# EAGLE schematic ENGI301_Project2b (EAGLE 8.7.0)
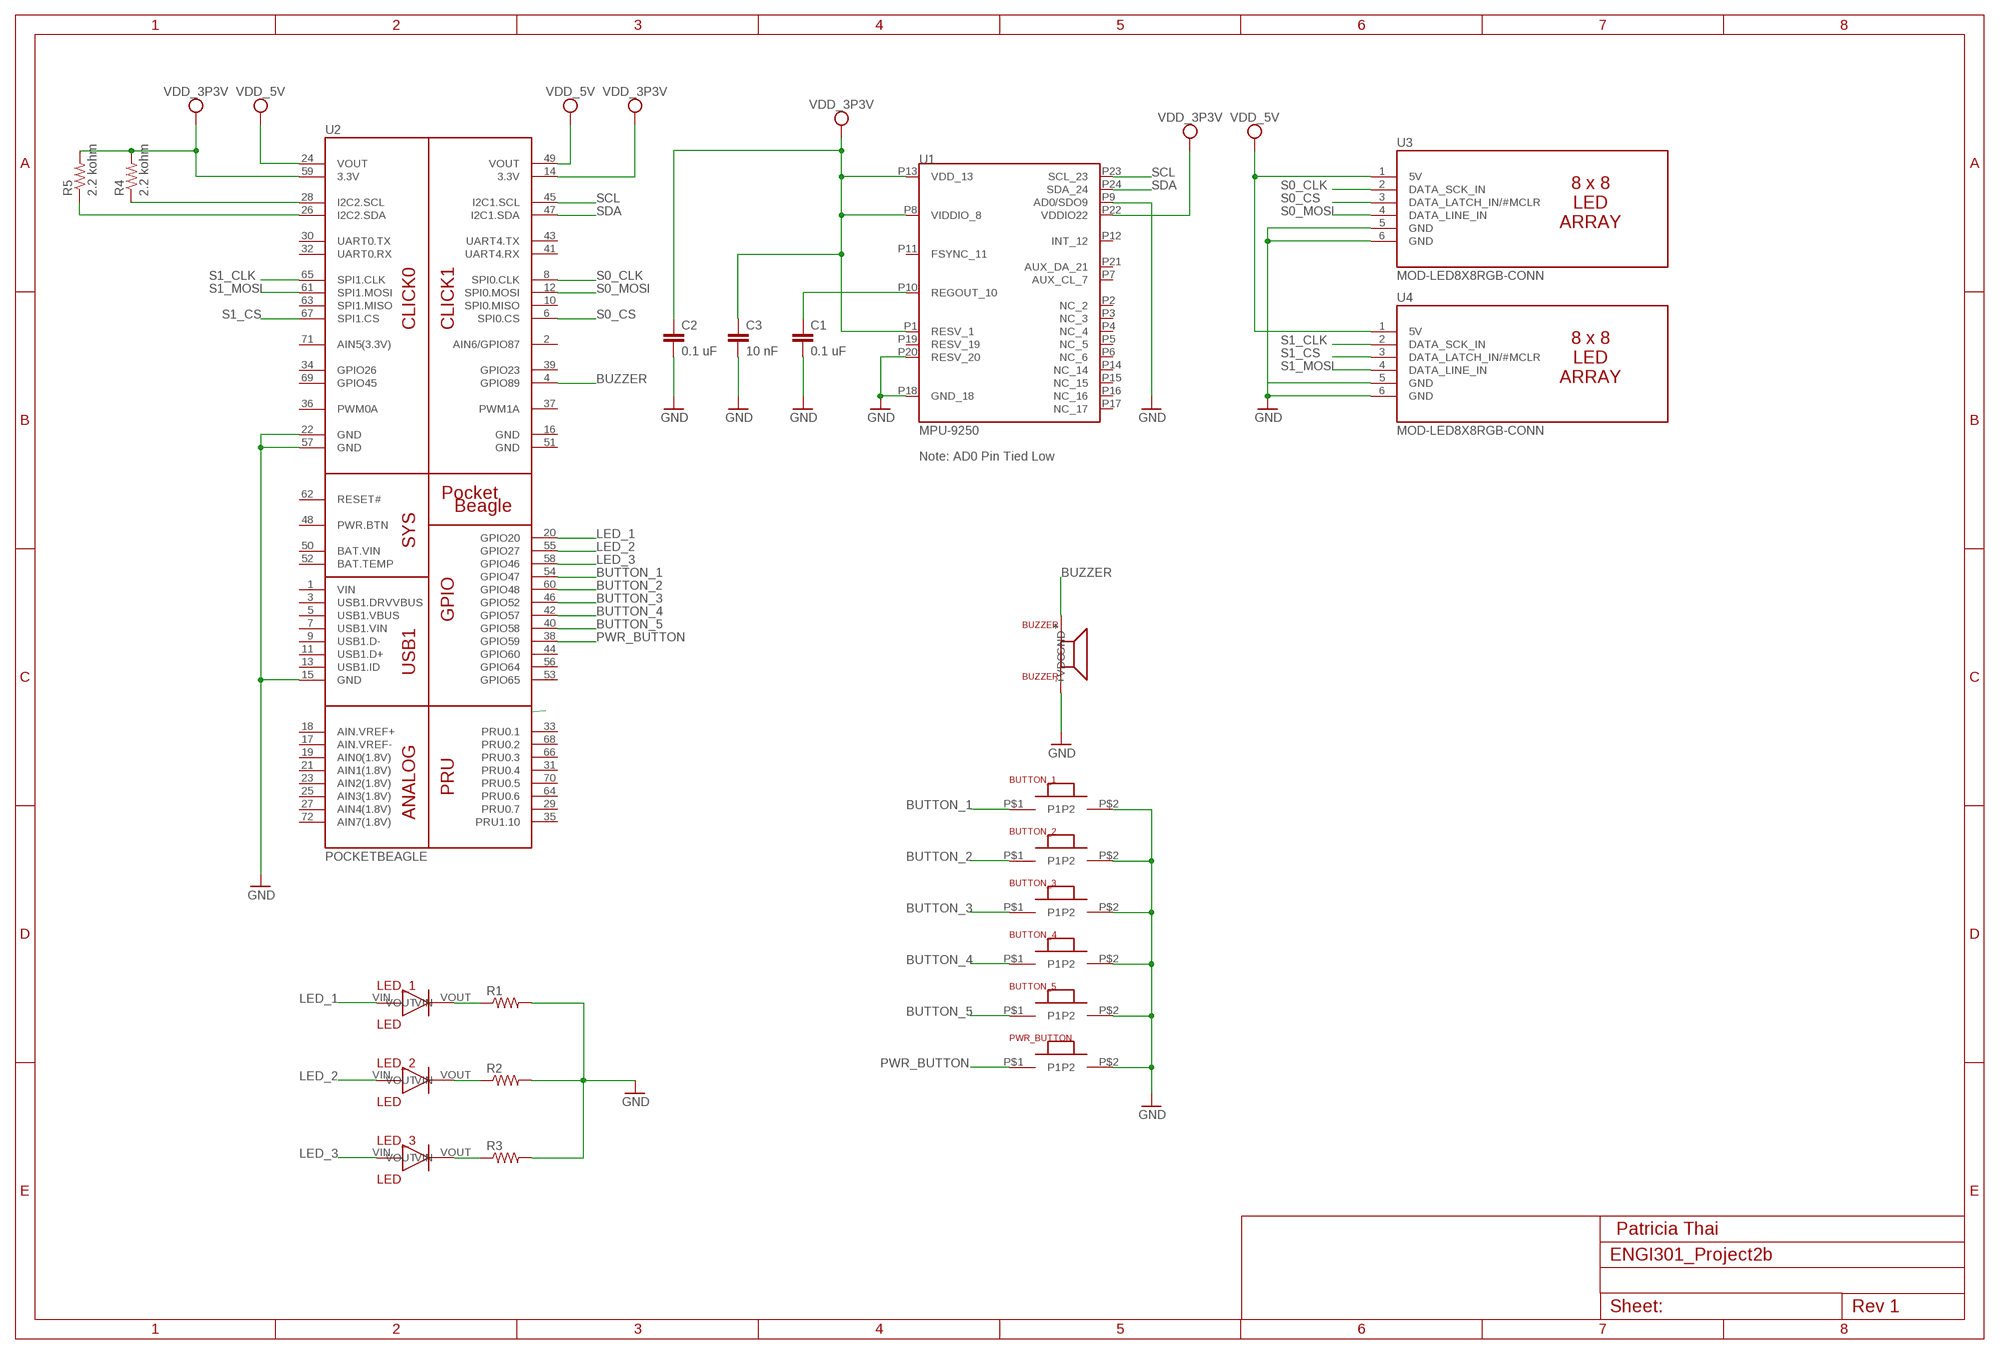
[diagram p0: schematic, sheet 1]

## Parts
BUTTON_1  BUTTON  [BUTTON]
BUTTON_2  BUTTON  [BUTTON]
BUTTON_3  BUTTON  [BUTTON]
BUTTON_4  BUTTON  [BUTTON]
BUTTON_5  BUTTON  [BUTTON]
BUZZER  BUZZER  [BUZZER]
C1  0.1 uF  C_C0603  [C0603]
C2  0.1 uF  C_C0603  [C0603]
C3  10 nF  C_C0603  [C0603]
LED_1  LED  [LED]
LED_2  LED  [LED]
LED_3  LED  [LED]
PWR_BUTTON  BUTTON  [BUTTON]
R1  R_R0603  [R0603]
R2  R_R0603  [R0603]
R3  R_R0603  [R0603]
R4  2.2 kohm  R_R0603  [R0603]
R5  2.2 kohm  R_R0603  [R0603]
U1  MPU-9250  [MPU-9250]
U2  POCKETBEAGLE  [POCKETBEAGLE]
U3  MOD-LED8X8RGB-CONN  [FE06W]
U4  MOD-LED8X8RGB-CONN  [FE06W]

## Nets
BUTTON_1: BUTTON_1.P$1(P1) U2.54(GPIO47)
BUTTON_2: BUTTON_2.P$1(P1) U2.60(GPIO48)
BUTTON_3: BUTTON_3.P$1(P1) U2.46(GPIO52)
BUTTON_4: BUTTON_4.P$1(P1) U2.42(GPIO57)
BUTTON_5: BUTTON_5.P$1(P1) U2.40(GPIO58)
BUZZER: BUZZER.+(+VDC) U2.4(GPIO89)
GND: BUTTON_1.P$2(P2) BUTTON_2.P$2(P2) BUTTON_3.P$2(P2) BUTTON_4.P$2(P2) BUTTON_5.P$2(P2) BUZZER.-(GND) C1.2 C2.2 C3.2 PWR_BUTTON.P$2(P2) R1.2 R2.2 R3.2 U1.P9(AD0/SDO9) U1.P18(GND_18) U1.P20(RESV_20) U2.15(GND) U2.22(GND) U2.57(GND) U3.5(GND) U3.6(GND) U4.5(GND) U4.6(GND)
LED_1: LED_1.VIN U2.20(GPIO20)
LED_2: LED_2.VIN U2.55(GPIO27)
LED_3: LED_3.VIN U2.58(GPIO46)
N$2: C1.1 U1.P10(REGOUT_10)
N$3: R5.1 U2.26(I2C2.SDA)
N$4: LED_1.VOUT R1.1
N$5: LED_2.VOUT R2.1
N$6: LED_3.VOUT R3.1
N$7: R4.1 U2.28(I2C2.SCL)
PWR_BUTTON: PWR_BUTTON.P$1(P1) U2.38(GPIO59)
S0_CLK: U2.8(SPI0.CLK) U3.2(DATA_SCK_IN)
S0_CS: U2.6(SPI0.CS) U3.3(DATA_LATCH_IN/#MCLR)
S0_MOSI: U2.12(SPI0.MOSI) U3.4(DATA_LINE_IN)
S1_CLK: U2.65(SPI1.CLK) U4.2(DATA_SCK_IN)
S1_CS: U2.67(SPI1.CS) U4.3(DATA_LATCH_IN/#MCLR)
S1_MOSI: U2.61(SPI1.MOSI) U4.4(DATA_LINE_IN)
SCL: U1.P23(SCL_23) U2.45(I2C1.SCL)
SDA: U1.P24(SDA_24) U2.47(I2C1.SDA)
SYS_VDD1_3P3V: C2.1 C3.1 R4.2 R5.2 U1.P1(RESV_1) U1.P8(VIDDIO_8) U1.P13(VDD_13) U1.P22(VDDIO22) U2.14(3.3V) U2.24(VOUT) U2.49(VOUT) U2.59(3.3V) U3.1(5V) U4.1(5V) ; supply symbol labelled VDD_3P3V, VDD_5V
Unconnected: U1.P2(NC_2) U1.P3(NC_3) U1.P4(NC_4) U1.P5(NC_5) U1.P6(NC_6) U1.P7(AUX_CL_7) U1.P11(FSYNC_11) U1.P12(INT_12) U1.P14(NC_14) U1.P15(NC_15) U1.P16(NC_16) U1.P17(NC_17) U1.P19(RESV_19) U1.P21(AUX_DA_21) U2.1(VIN) U2.2(AIN6/GPIO87) U2.3(USB1.DRVVBUS) U2.5(USB1.VBUS) U2.7(USB1.VIN) U2.9(USB1.D-) U2.10(SPI0.MISO) U2.11(USB1.D+) U2.13(USB1.ID) U2.16(GND) U2.17(AIN.VREF-) U2.18(AIN.VREF+) U2.19(AIN0(1.8V)) U2.21(AIN1(1.8V)) U2.23(AIN2(1.8V)) U2.25(AIN3(1.8V)) U2.27(AIN4(1.8V)) U2.29(PRU0.7) U2.30(UART0.TX) U2.31(PRU0.4) U2.32(UART0.RX) U2.33(PRU0.1) U2.34(GPIO26) U2.35(PRU1.10) U2.36(PWM0A) U2.37(PWM1A) U2.39(GPIO23) U2.41(UART4.RX) U2.43(UART4.TX) U2.44(GPIO60) U2.48(PWR.BTN) U2.50(BAT.VIN) U2.51(GND) U2.52(BAT.TEMP) U2.53(GPIO65) U2.56(GPIO64) U2.62(RESET#) U2.63(SPI1.MISO) U2.64(PRU0.6) U2.66(PRU0.3) U2.68(PRU0.2) U2.69(GPIO45) U2.70(PRU0.5) U2.71(AIN5(3.3V)) U2.72(AIN7(1.8V))

## Notes on the sheet
- Note: AD0 Pin Tied Low
- Patricia Thai

## Library data of the parts
BUTTON_1-BUTTON_5 PWR_BUTTON = ENGI 301 - Project 2a:BUTTON
BUZZER = ENGI 301 - Project 2a:BUZZER
C1-C3 = ENGI 301 - Project 2a:C_: Capacitor SMD. Sizes: 0402, 0603 & 0805
LED_1-LED_3 = ENGI 301 - Project 2a:LED
R1-R3 = ENGI 301 - Project 2a:R_: RESISTOR, American symbol
R4 R5 = ENGI301_design_example:R_: RESISTOR, American symbol
U1 = ENGI 301 - Project 2a:MPU-9250
U2 = ENGI301_Maze_Project_Parts:POCKETBEAGLE
U3 U4 = ENGI301_Maze_Project_Parts:MOD-LED8X8RGB-CONN